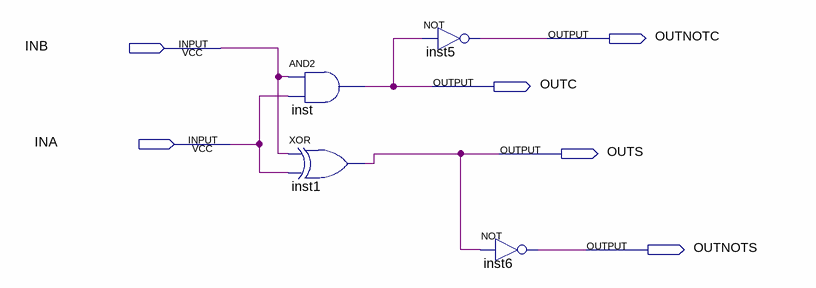
[diagram p0: schematic sheet]
// Quartus schematic halfsum.bdf as structural Verilog: 4 symbols, 6 pins
module halfsum (
  input  INB,
  input  INA,
  output OUTNOTC,
  output OUTC,
  output OUTS,
  output OUTNOTS
);

  and inst (OUTC, INB, INA);
  xor inst1 (OUTS, INB, INA);
  not inst5 (OUTNOTC, OUTC);
  not inst6 (OUTNOTS, OUTS);
endmodule
